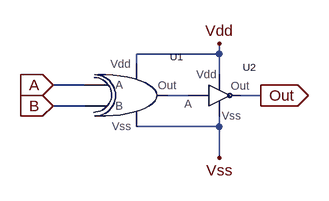
[diagram p0: schematic XNOR1.asc]
XNOR1.asc, the LTspice schematic file:
Version 4
SHEET 1 880 680
WIRE 560 64 560 48
WIRE 560 64 432 64
WIRE 432 80 432 64
WIRE 560 96 560 64
WIRE 352 112 304 112
WIRE 512 128 480 128
WIRE 624 128 592 128
WIRE 352 144 304 144
WIRE 560 176 560 160
WIRE 560 176 432 176
WIRE 560 224 560 176
FLAG 304 112 A
IOPIN 304 112 In
FLAG 304 144 B
IOPIN 304 144 In
FLAG 624 128 Out
IOPIN 624 128 Out
FLAG 560 48 Vdd
FLAG 560 224 Vss
SYMBOL XOR1 368 128 R0
SYMATTR InstName U1
SYMBOL NOT1 544 128 R0
SYMATTR InstName U2

The netlist it stands for:
* XNOR1.asc
XU1 Vdd Vss N001 A B XOR1  ; pins Vdd Vss Out A B
XU2 Vdd Vss N001 Out NOT1  ; pins Vdd Vss A Out
.lib XOR1.sub
.lib NOT1.sub
.backanno
.end